# EAGLE design led (EAGLE 6.5.0)
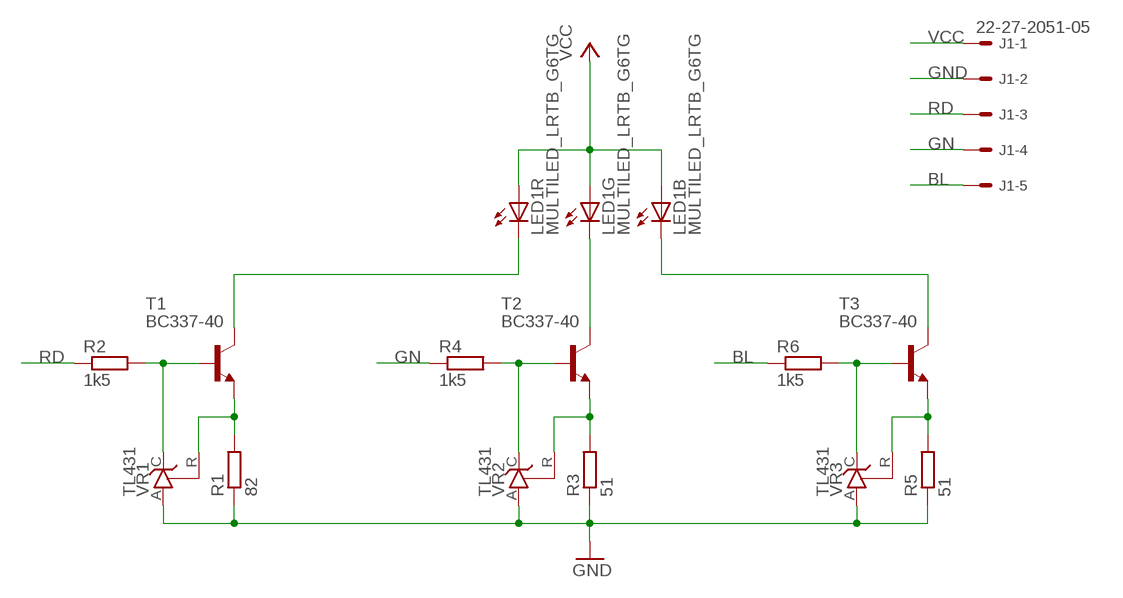
[diagram p0: schematic, sheet 1]

## Parts
J1  22-27-2051-05  [6410-05]
LED1  MULTILED_LRTB_G6TG  [P-LCC-6_TOPLED]
R1  82  R-EU_0207/7  [0207/7]
R2  1k5  R-EU_R0805  [R0805]
R3  51  R-EU_0207/7  [0207/7]
R4  1k5  R-EU_0207/10  [0207/10]
R5  51  R-EU_0207/7  [0207/7]
R6  1k5  R-EU_R0805  [R0805]
T1  BC337-40  BC337-40-NPN-TO92-CBE  [TO92-CBE]
T2  BC337-40  BC337-40-NPN-TO92-CBE  [TO92-CBE]
T3  BC337-40  BC337-40-NPN-TO92-CBE  [TO92-CBE]
VR1  TL431  TL431CLP  [TO92-CLP]
VR2  TL431  TL431CLP  [TO92-CLP]
VR3  TL431  TL431CLP  [TO92-CLP]

## Nets
BL: J1.5 R6.1
GN: J1.4 R4.1
GND [supply]: J1.2 R1.1 R3.1 R5.1 VR1.A VR2.A VR3.A
N$1: R1.2 T1.E VR1.R
N$2: R3.2 T2.E VR2.R
N$3: R2.2 T1.B VR1.C
N$4: R4.2 T2.B VR2.C
N$7: LED1.C1(R:C) T1.C
N$10: LED1.C2(G:C) T2.C
RD: J1.3 R2.1
T3_B-C: R6.2 T3.B VR3.C
T3_C: LED1.C3(B:C) T3.C
T3_E-R: R5.2 T3.E VR3.R
VCC: J1.1 LED1.A1(R:A) LED1.A2(G:A) LED1.A3(B:A)

## Library data of the parts
J1 = con-molex:22-?-05: CONNECTOR wire to board 2.54 mm (.1 inch) pitch header; OC_FARNELL: unknown; OC_NEWARK: unknown
LED1 = led:MULTILED_LRTB_G6TG: 6-lead MULTILED® Enhanced optical Power LED (ThinFilm® / ThinGaN®) Source. OSRAM - LRTB_G6TG.pdf
R1-R6 = rcl:R-EU_: RESISTOR, European symbol
T1-T3 = transistor:*-NPN-: NPN Transistror BF959 corrected 2008.03.06
VR1-VR3 = v-reg:TL431CLP: VOLTAGE REGULATOR

## Net classes
1 supply: width 0.406 mm

## Board
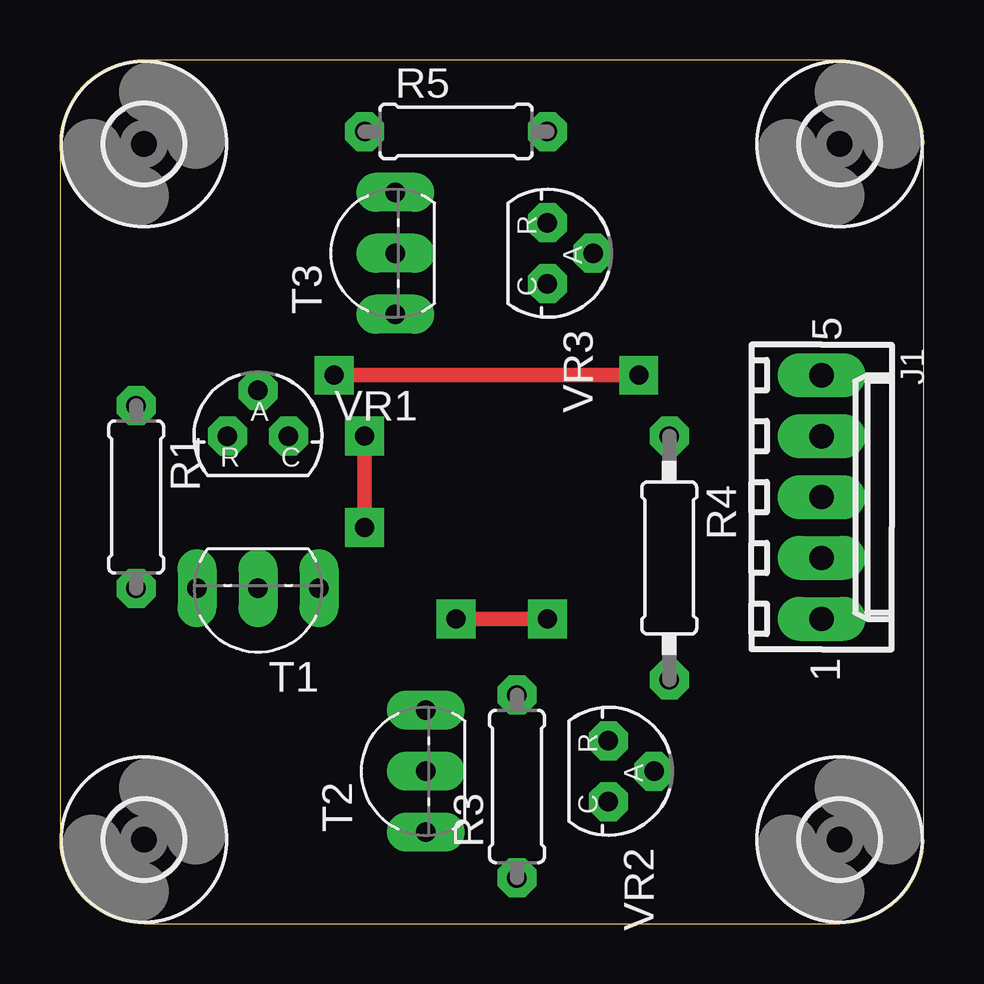
[diagram p1: board, top side]
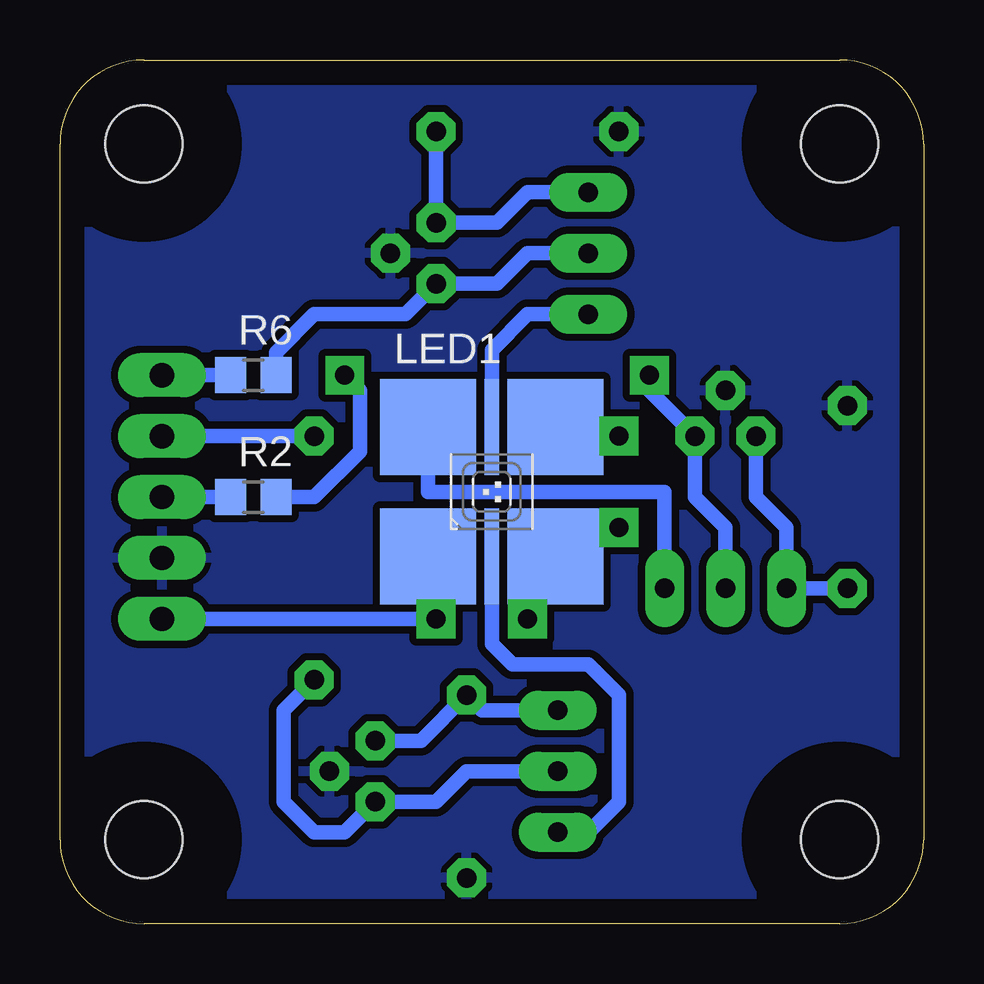
[diagram p2: board, bottom side, seen from below]

Size 36 x 36 mm. Coordinates in mm from the lower left corner, seen from the top.
Outline: 3.5,0 32.5,0 arc90 36,3.5 36,32.5 arc90 32.5,36 3.5,36 arc90 0,32.5 0,3.5 arc90 3.5,0
Copper layers (1*16): Top 0.035mm / dielectric 1.5mm / Bottom 0.035mm
Design rules "default *": minimum track width 12mil, minimum drill 0.6mm, track to track 12mil, track to pad 12mil, pad to pad 12mil, via to via 12mil, smd to smd 8mil, copper to edge 40mil, drill to drill 12mil, minimum pad ring 16mil, minimum via ring 16mil, stop-mask expansion 4mil, vias tented up to drill 0mil, thermal gap 10mil

### Footprints (pad centres in the part's own frame; a part is rotated, then mirrored left to right if it is on the bottom)
6410-05 = drill 1.016 long: 1 5.08,0; 2 2.54,0; 3 0,0; 4 -2.54,0; 5 -5.08,0
P-LCC-6_TOPLED = smd 4 x 4: A1 -2.65,-2.7; A2 2.65,-2.7; A3 2.65,2.7; C1 -2.65,2.7 | smd 0.6 x 4: C2 0,-2.7; C3 0,2.7
0207/7 = drill 0.813 octagon: 1 -3.81,0; 2 3.81,0
R0805 = smd 1.3 x 1.5: 1 -0.95,0; 2 0.95,0
0207/10 = drill 0.813 octagon: 1 -5.08,0; 2 5.08,0
TO92-CBE = drill 0.813 long: B 0,0; C -2.54,0; E 2.54,0
3,2 = hole 3.2: 0,0
TO92-CLP = drill 0.813 octagon: A 0,1.905; C 1.27,0; R -1.27,0

### Placement (x,y rotation side)
J1  31.75,17.78 270 top
LED1  18,18 0 bottom
R1  3.17,17.78 270 top
R2  27.94,17.78 0 bottom
R3  19.05,5.71 90 top
R4  25.4,15.24 270 top
R5  16.51,33.02 0 top
R6  27.94,22.86 0 bottom
T1  8.26,13.97 180 top
T2  15.24,6.35 90 top
T3  13.97,27.94 90 top
U$1  [3,2]  3.5,32.5 0 top
U$2  [3,2]  32.5,32.5 0 top
U$3  [3,2]  32.5,3.5 0 top
U$4  [3,2]  3.5,3.5 0 top
VR1  8.26,20.32 0 top
VR2  22.86,6.35 270 top
VR3  20.32,27.94 270 top

### Tracks (layer width: path | path; a pad name or v marks a point on that pad's centre or on a via)
BL
  Bottom 0.61: J1.5 R6.1
GN
  Bottom 0.61: J1.4 R4.1
GND
  pour Bottom: 32.5,0 arc90 36,3.5 36,32.5 arc90 32.5,36 3.5,36 arc90 0,32.5 0,3.5 arc90 3.5,0
N$1
  Bottom 0.61: R1.2 T1.E 5.71,16.51 6.99,17.78 VR1.R
N$2
  Bottom 0.61: T2.E 18.41,8.89 R3.2 20.95,7.62 VR2.R
N$3  (via drill 0.8)
  Top 0.61: v24.13,22.86 v11.43,22.86
  Bottom 0.61: T1.B 8.26,16.51 9.53,17.78 VR1.C 11.43,22.23 v11.43,22.86 | R2.2 25.4,17.78 23.5,19.68 23.5,22.23 v24.13,22.86
N$4
  Bottom 0.61: T2.B 19.05,6.35 20.32,5.08 VR2.C 24.13,3.81 25.4,3.81 26.67,5.08 26.67,8.89 R4.2
N$7
  Bottom 0.61: LED1.C1 20.65,18 10.79,18 T1.C
N$10
  Bottom 0.61: LED1.C2 18,11.65 17.14,10.79 13.97,10.79 12.7,9.53 12.7,5.08 13.97,3.81 T2.C
RD
  Bottom 0.61: J1.3 R2.1
T3_B-C
  Bottom 0.61: T3.B 16.51,27.94 17.78,26.67 VR3.C 21.59,25.4 25.4,25.4 26.99,23.81 R6.2
T3_C
  Bottom 0.61: LED1.C3 18,23.91 16.51,25.4 T3.C
T3_E-R
  Bottom 0.61: T3.E 16.51,30.48 17.78,29.21 VR3.R R5.2
VCC  (via drill 0.8)
  Top 0.61: v12.7,20.32 v12.7,16.51 | v16.51,12.7 v20.32,12.7
  Bottom 0.61: LED1.A3 14.97,20.32 v12.7,20.32 | v12.7,16.51 15.35,16.51 LED1.A2 16.51,15.3 v16.51,12.7 | v20.32,12.7 20.32,15.3 LED1.A1 20.65,12.7 J1.1